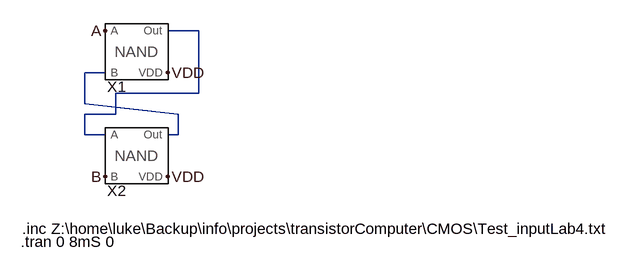
[diagram p0: schematic Lab--.asc]
Lab--.asc, the LTspice schematic file:
Version 4
SHEET 1 1068 680
WIRE 240 16 192 16
WIRE 96 80 64 80
WIRE 240 112 240 16
WIRE 240 112 112 112
WIRE 64 128 64 80
WIRE 112 144 112 112
WIRE 112 144 64 144
WIRE 208 144 64 128
WIRE 64 176 64 144
WIRE 96 176 64 176
WIRE 208 176 208 144
WIRE 208 176 192 176
FLAG 96 240 B
FLAG 96 16 A
FLAG 192 80 VDD
FLAG 192 240 VDD
SYMBOL Gate_NAND 144 48 R0
SYMATTR InstName X1
SYMBOL Gate_NAND 144 208 R0
SYMATTR InstName X2
TEXT -32 320 Left 2 !.inc Z:\\home\\luke\\Backup\\info\\projects\\transistorComputer\\CMOS\\Test_inputLab4.txt
TEXT -34 340 Left 2 !.tran 0 8mS 0

The netlist it stands for:
* Lab--.asc
XX1 A N002 N001 VDD Gate_NAND  ; pins A B Out VDD
XX2 N001 B N002 VDD Gate_NAND  ; pins A B Out VDD
.inc Z:\home\luke\Backup\info\projects\transistorComputer\CMOS\Test_inputLab4.txt
.tran 0 8mS 0
.backanno
.end